# EAGLE board motor_shield (EAGLE 9.2.1)
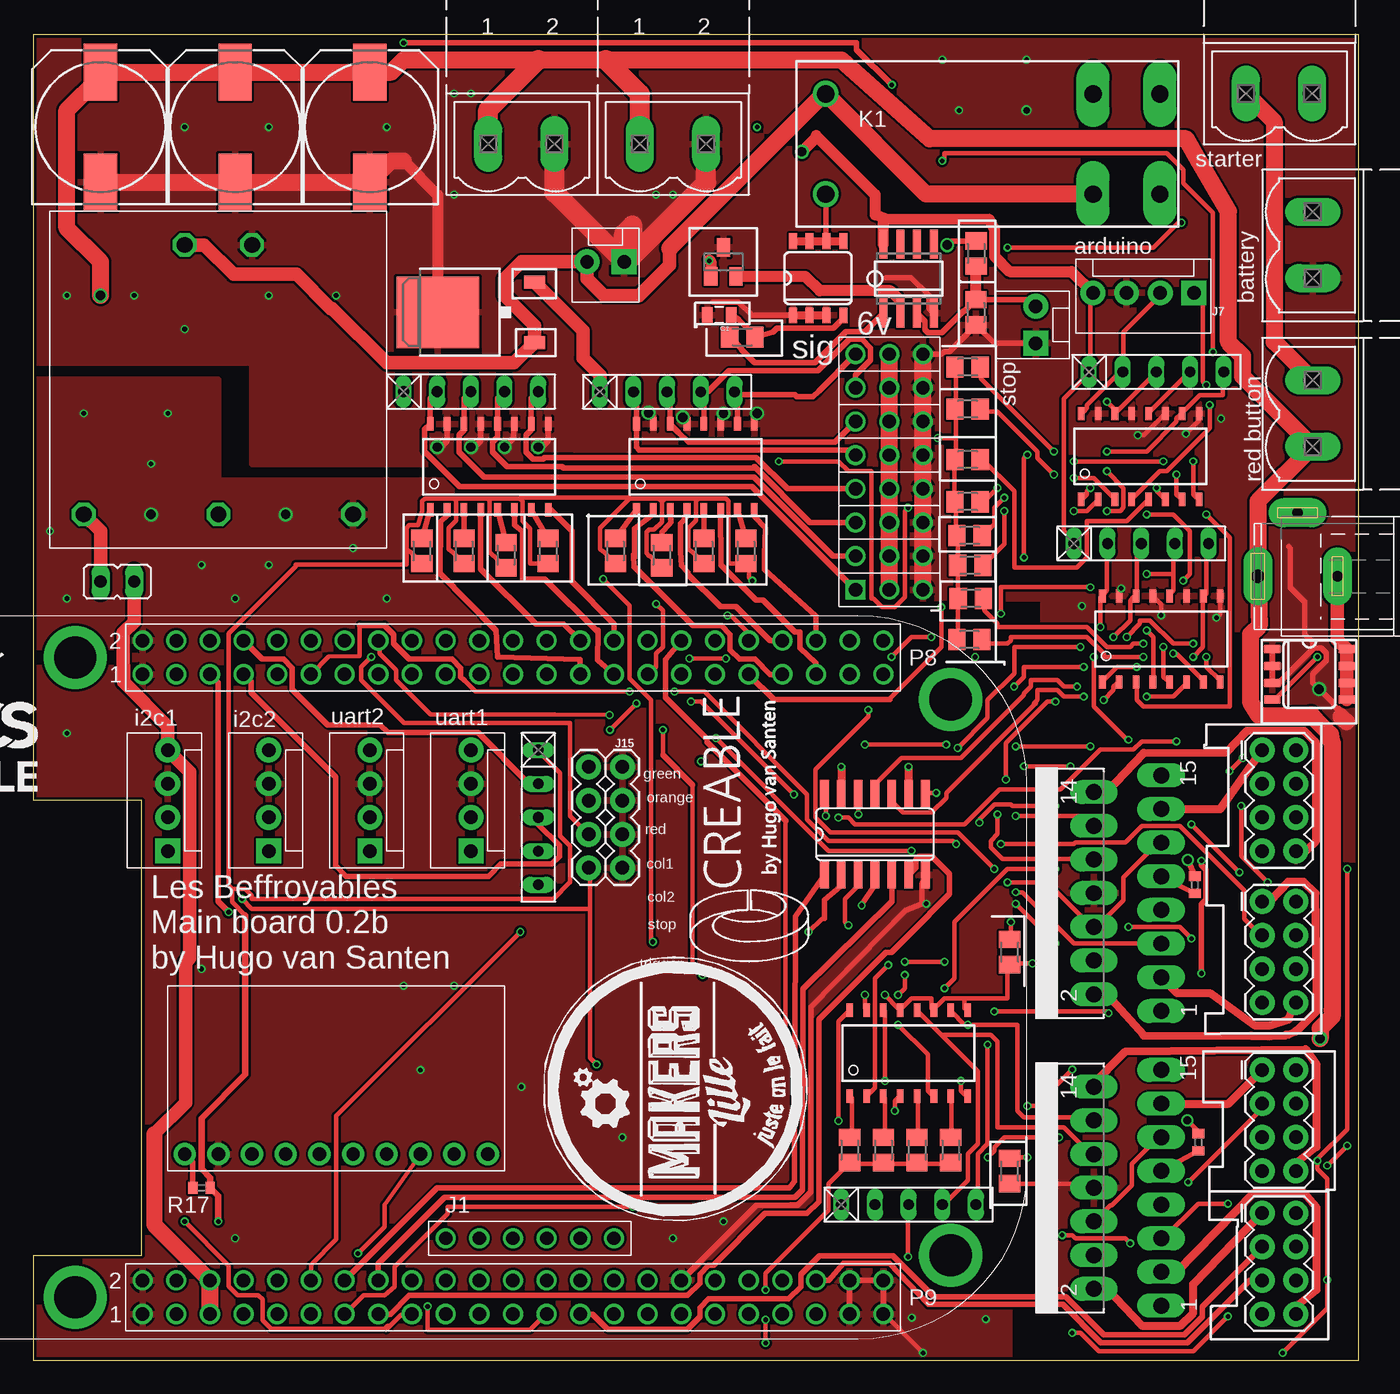
[diagram p3: board, top side]
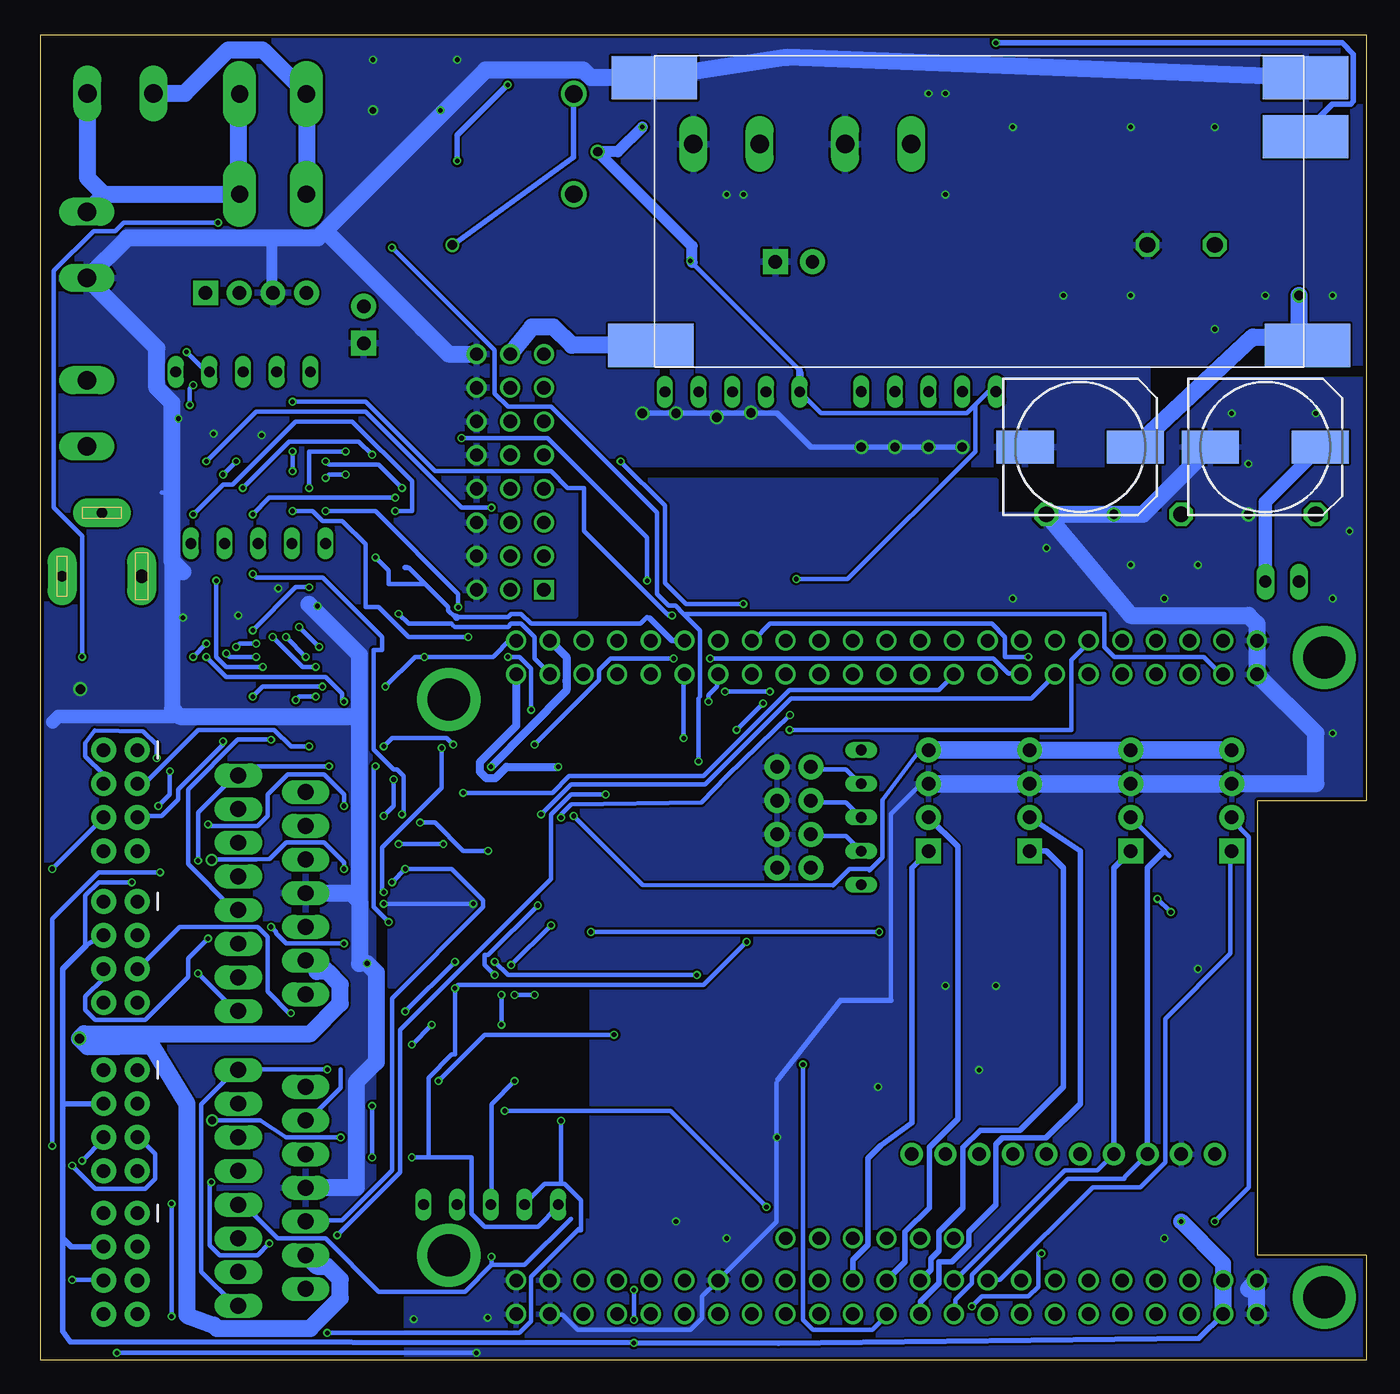
[diagram p4: board, bottom side, seen from below]

Size 100 x 100 mm. Coordinates in mm from the lower left corner, seen from the top.
Outline: 0,0 100,0 100,100 0,100 0,42.23 8.19,42.23 8.19,7.94 0,7.94 0,0
Copper layers (1*16): Top 0.035mm / dielectric 1.55mm / Bottom 0.035mm
Design rules "eC_2Layer_PClass6_BaseCopperO35 *": minimum track width 0.35mm, minimum drill 0.35mm, track to track 0.175mm, track to pad 0.175mm, pad to pad 0.175mm, via to via 0.175mm, smd to smd 0mil, copper to edge 0.25mm, drill to drill 0.35mm, minimum pad ring 0.175mm, minimum via ring 0.125mm, stop-mask expansion 0mil, vias tented up to drill 0.4mm, thermal gap 0.2mm

## Footprints (pad centres in the part's own frame; a part is rotated, then mirrored left to right if it is on the bottom)
SPARKFUN-CAPACITORS_0805 = smd 0.8 x 1.2: 1 -0.9,0; 2 0.9,0
ADAFRUIT_140CLH-1010 = smd 4.3 x 2.5: + 4.15,0; - -4.15,0
MULTIWATT-15 = drill 1.2 long: 1 -8.89,-7.62; 2 -7.62,-2.54; 3 -6.35,-7.62; 4 -5.08,-2.54; 5 -3.81,-7.62; 6 -2.54,-2.54; 7 -1.27,-7.62; 8 0,-2.54; 9 1.27,-7.62; 10 2.54,-2.54; 11 3.81,-7.62; 12 5.08,-2.54; 13 6.35,-7.62; 14 7.62,-2.54; 15 8.89,-7.62
SO14 = smd 0.66 x 2.032: 1 -3.81,-3.073; 2 -2.54,-3.073; 3 -1.27,-3.073; 4 0,-3.073; 5 1.27,-3.073; 6 2.54,-3.073; 7 3.81,-3.073; 8 3.81,3.073; 9 2.54,3.073; 10 1.27,3.073; 11 0,3.073; 12 -1.27,3.073; 13 -2.54,3.073; 14 -3.81,3.073
TO252 = smd 1 x 1.6: 1 -2.28,-4.8; 2 2.28,-4.8 | smd 5.4 x 6.2: 3 0,2.5
SOT23 = smd 1 x 1.4: 1 -0.95,-1.1; 2 0.95,-1.1; 3 0,1.1
SO08 = smd 0.6 x 2.2: 1 -1.905,-2.6; 2 -0.635,-2.6; 3 0.635,-2.6; 4 1.905,-2.6; 5 1.905,2.6; 6 0.635,2.6; 7 -0.635,2.6; 8 -1.905,2.6
2X4 = drill 1.016 pad 1.88: 1 -3.81,-1.27; 2 -3.81,1.27; 3 -1.27,-1.27; 4 -1.27,1.27; 5 1.27,-1.27; 6 1.27,1.27; 7 3.81,-1.27; 8 3.81,1.27
MOLEX-1X4 = drill 1.016 pad 1.88 square: 1 0,0 | drill 1.016 pad 1.88: 2 2.54,0; 3 5.08,0; 4 7.62,0
SPC4078 = drill 0.8 pad 2.184 long: 1 -3,0; 2 0,-4.8 | drill 1 pad 2.184 long: 3 3,0
MOLEX-1X2_LOCK = drill 1.016 pad 1.88 square: 1 -0.127,0 | drill 1.016 pad 1.88: 2 2.667,0
1X04 = drill 1.016 pad 1.88: 1 0,0; 2 2.54,0; 3 5.08,0; 4 7.62,0
JP1 = drill 0.914 long: 1 0,-1.27; 2 0,1.27
RT-N/O16A5 = drill 1.3 pad 2.5 long: 11A 7.56,3.78; 11B 7.56,-3.78; 14A 12.6,3.78; 14B 12.6,-3.78 | drill 1.3: A1 -12.6,-3.78; A2 -12.6,3.78
MINI-FLAT-16 = smd 1 x 0.5: 1 -3.24,4.445; 2 -3.24,3.175; 3 -3.24,1.905; 4 -3.24,0.635; 5 -3.24,-0.635; 6 -3.24,-1.905; 7 -3.24,-3.175; 8 -3.24,-4.445; 9 3.24,-4.445; 10 3.24,-3.175; 11 3.24,-1.905; 12 3.24,-0.635; 13 3.24,0.635; 14 3.24,1.905; 15 3.24,3.175; 16 3.24,4.445
BEAGLEBONE_BLACK_CAPE = drill 3.175: H1 14.605,3.175; H2 80.645,6.35; H3 80.645,48.26; H4 14.605,51.435 | drill 1.016: J1.1 42.545,7.62; J1.2 45.085,7.62; J1.3 47.625,7.62; J1.4 50.165,7.62; J1.5 52.705,7.62; J1.6 55.245,7.62; P8.1 19.685,50.165; P8.2 19.685,52.705; P8.3 22.225,50.165; P8.4 22.225,52.705; P8.5 24.765,50.165; P8.6 24.765,52.705; P8.7 27.305,50.165; P8.8 27.305,52.705; P8.9 29.845,50.165; P8.10 29.845,52.705; P8.11 32.385,50.165; P8.12 32.385,52.705; P8.13 34.925,50.165; P8.14 34.925,52.705; P8.15 37.465,50.165; P8.16 37.465,52.705; P8.17 40.005,50.165; P8.18 40.005,52.705; P8.19 42.545,50.165; P8.20 42.545,52.705; P8.21 45.085,50.165; P8.22 45.085,52.705; P8.23 47.625,50.165; P8.24 47.625,52.705; P8.25 50.165,50.165; P8.26 50.165,52.705; P8.27 52.705,50.165; P8.28 52.705,52.705; P8.29 55.245,50.165; P8.30 55.245,52.705; P8.31 57.785,50.165; P8.32 57.785,52.705; P8.33 60.325,50.165; P8.34 60.325,52.705; P8.35 62.865,50.165; P8.36 62.865,52.705; P8.37 65.405,50.165; P8.38 65.405,52.705; P8.39 67.945,50.165; P8.40 67.945,52.705; P8.41 70.485,50.165; P8.42 70.485,52.705; P8.43 73.025,50.165; P8.44 73.025,52.705; P8.45 75.565,50.165; P8.46 75.565,52.705; P9.1 19.685,1.905; P9.2 19.685,4.445; P9.3 22.225,1.905; P9.4 22.225,4.445; P9.5 24.765,1.905; P9.6 24.765,4.445; P9.7 27.305,1.905; P9.8 27.305,4.445; P9.9 29.845,1.905; P9.10 29.845,4.445; P9.11 32.385,1.905; P9.12 32.385,4.445; P9.13 34.925,1.905; P9.14 34.925,4.445; P9.15 37.465,1.905; P9.16 37.465,4.445; P9.17 40.005,1.905; P9.18 40.005,4.445; P9.19 42.545,1.905; P9.20 42.545,4.445; P9.21 45.085,1.905; P9.22 45.085,4.445; P9.23 47.625,1.905; P9.24 47.625,4.445; P9.25 50.165,1.905; P9.26 50.165,4.445; P9.27 52.705,1.905; P9.28 52.705,4.445; P9.29 55.245,1.905; P9.30 55.245,4.445; P9.31 57.785,1.905; P9.32 57.785,4.445; P9.33 60.325,1.905; P9.34 60.325,4.445; P9.35 62.865,1.905; P9.36 62.865,4.445; P9.37 65.405,1.905; P9.38 65.405,4.445; P9.39 67.945,1.905; P9.40 67.945,4.445; P9.41 70.485,1.905; P9.42 70.485,4.445; P9.43 73.025,1.905; P9.44 73.025,4.445; P9.45 75.565,1.905; P9.46 75.565,4.445
STRAWSON_EAGLE_LIB_SO08-TIGHT = smd 0.6 x 1.2: 1 -1.905,-2.8; 2 -0.635,-2.8; 3 0.635,-2.8; 4 1.905,-2.8; 5 1.905,2.8; 6 0.635,2.8; 7 -0.635,2.8; 8 -1.905,2.8
M0805 = smd 1.3 x 1.6: 1 -0.95,0; 2 0.95,0
R0402 = smd 0.7 x 0.9: 1 -0.65,0; 2 0.65,0
RN-5 = drill 0.813 long: 1 -5.08,0; 2 -2.54,0; 3 0,0; 4 2.54,0; 5 5.08,0
WRA-YMD = drill 1.194 octagon: (NC) 12.7,22.86; GND 10.16,2.54; V+ 22.86,22.86; V- 2.54,22.86; VIN 15.24,2.54
MPU9250 = drill 1 pad 1.676: AD0 0,7.62; ECL 0,10.16; EDA 0,12.7; FASYNC 0,0; GND 0,20.32; INT 0,5.08; NCS 0,2.54; SCL 0,17.78; SDA 0,15.24; VCC 0,22.86
STRAWSON_EAGLE_LIB_3X8_0.1"_HEADER = drill 1 square: P$1 -2.54,-17.78 | drill 1: P$2 -2.54,-15.24; P$3 -2.54,-12.7; P$4 -2.54,-10.16; P$5 -2.54,-7.62; P$6 -2.54,-5.08; P$7 0,-17.78; P$8 0,-15.24; P$9 0,-12.7; P$10 0,-10.16; P$11 0,-7.62; P$12 0,-5.08; P$13 2.54,-17.78; P$14 2.54,-15.24; P$15 2.54,-12.7; P$16 2.54,-10.16; P$17 2.54,-7.62; P$18 2.54,-5.08; P$19 -2.54,-2.54; P$20 -2.54,0; P$21 0,-2.54; P$22 0,0; P$23 2.54,-2.54; P$24 2.54,0
XL6009 = smd 6.452 x 3.251: EN -0.127,6.096; IN+ -0.254,21.844; IN- -0.127,1.651; OUT+ 49.276,21.844; OUT- 49.022,1.651
MSTBV2 = drill 1.397 long: 1 -2.5,0; 2 2.5,0

## Placement (x,y rotation side)
C1  [SPARKFUN-CAPACITORS_0805]  51.76,78.85 180 top
C2  [ADAFRUIT_140CLH-1010]  5.08,93.03 90 top
C3  [ADAFRUIT_140CLH-1010]  15.24,93.03 90 top
C4  [ADAFRUIT_140CLH-1010]  25.4,93.03 90 top
C5  [ADAFRUIT_140CLH-1010]  21.59,68.9 0 bottom
C6  [ADAFRUIT_140CLH-1010]  7.62,68.9 0 bottom
IC1  L298  [MULTIWATT-15]  77.47,13.02 90 top
IC2  L298  [MULTIWATT-15]  77.47,35.24 90 top
IC3  4030D  [SO14]  63.5,39.69 0 top
IC4  7805DT  [TO252]  33.02,79.06 90 top
IC5  MAX6520  [SOT23]  52.07,82.87 0 top
IC6  LM358D  [SO08]  66.04,81.6 0 top
J1  [2X4]  93.98,7.3 270 top
J2  [MOLEX-1X4]  25.4,38.42 90 top
J3  [2X4]  93.98,18.1 270 top
J4  [2X4]  93.98,30.8 270 top
J5  [2X4]  93.98,42.23 270 top
J6  [MOLEX-1X4]  33.02,38.42 90 top
J7  [MOLEX-1X4]  87.56,80.52 180 top
J8  [MOLEX-1X4]  10.16,38.42 90 top
J9  [MOLEX-1X4]  17.78,38.42 90 top
J11  [SPC4078]  95.38,59.14 180 top
J12  [MOLEX-1X2_LOCK]  75.64,76.85 90 top
J14  [MOLEX-1X2_LOCK]  44.45,82.87 180 top
J15  [1X04]  44.45,44.77 270 top
J16  [1X04]  41.91,37.15 90 top
JP1  [JP1]  6.35,58.74 270 top
K1  RT33K012  [RT-N/O16A5]  72.39,91.76 0 top
OPT_MISC  TLP283-4  [MINI-FLAT-16]  83.5,68.19 90 top
OPT_MOT1  TLP283-4  [MINI-FLAT-16]  66.04,23.18 90 top
OPT_MOT2  TLP283-4  [MINI-FLAT-16]  85.1,54.41 90 top
OPT_SERVO1  TLP283-4  [MINI-FLAT-16]  34.4,67.4 90 top
OPT_SERVO2  TLP283-4  [MINI-FLAT-16]  49.96,67.4 90 top
PCB1  BEAGLEBONE_BLACK_CAPE  [BEAGLEBONE_BLACK_CAPE]  -11.43,1.59 0 top
Q5  STRAWSON_EAGLE_LIB_MOSFET-NCHANNEL  [STRAWSON_EAGLE_LIB_SO08-TIGHT]  96.28,51.74 270 top
Q6  STRAWSON_EAGLE_LIB_MOSFET-NCHANNEL  [STRAWSON_EAGLE_LIB_SO08-TIGHT]  59.21,81.63 0 top
R1  0.5  [M0805]  73.66,14.29 270 top
R2  0.5  [M0805]  73.66,30.8 270 top
R3  220  [M0805]  70.64,62.22 0 top
R4  6k  [M0805]  53.5,77.18 180 top
R5  220  [M0805]  70.69,59.97 0 top
R7  220  [M0805]  70.73,57.48 0 top
R9  220  [M0805]  70.63,54.37 0 top
R11  6k  [M0805]  71.14,83.49 90 top
R12  3k  [M0805]  71.12,79.06 90 top
R15  [R0402]  87.91,16.45 270 top
R16  [R0402]  87.63,35.88 270 top
R17  [R0402]  12.7,13.02 180 top
R19  220  [M0805]  61.59,15.88 90 top
R21  220  [M0805]  64.14,15.88 90 top
R23  220  [M0805]  66.67,15.88 90 top
R25  220  [M0805]  69.22,15.88 90 top
R27  220  [M0805]  70.48,74.93 0 top
R29  220  [M0805]  70.48,71.75 0 top
R31  220  [M0805]  70.48,67.94 0 top
R33  220  [M0805]  70.48,64.77 0 top
R35  220  [M0805]  29.32,61.05 90 top
R37  220  [M0805]  32.5,61.05 90 top
R39  220  [M0805]  35.67,60.74 90 top
R41  220  [M0805]  38.85,61.05 90 top
R51  220  [M0805]  43.93,61.05 90 top
R53  220  [M0805]  47.42,60.74 90 top
R55  220  [M0805]  50.59,61.05 90 top
R57  220  [M0805]  53.77,61.05 90 top
RN2  680  [RN-5]  84.73,74.56 0 top
RN3  680  [RN-5]  66.04,11.75 0 top
RN4  680  [RN-5]  83.59,61.62 0 top
RN5  680  [RN-5]  47.82,73.07 0 top
RN6  680  [RN-5]  33.02,73.07 0 top
RN7  [RN-5]  38.1,40.96 270 top
U$1  WRA-YMD  [WRA-YMD]  26.67,86.68 180 top
U$2  MPU9220  [MPU9250]  34.29,15.56 90 top
U$3  LOGO  [LOGO]  58.54,30.03 90 top
U$4  STRAWSON_EAGLE_LIB_SERVO_HEADERS_8X  [STRAWSON_EAGLE_LIB_3X8_0.1"_HEADER]  64.58,75.91 0 top
U$5  XL6009  [XL6009]  4.7,98.41 180 bottom
U$6  LOGO_MAKERS  [LOGO_MAKERS]  58.42,10.48 90 top
X1  [MSTBV2]  96.52,71.44 270 top
X2  [MSTBV2]  93.98,95.57 0 top
X3  [MSTBV2]  96.52,84.14 270 top
X5  [MSTBV2]  48.26,91.76 0 top
X6  [MSTBV2]  36.83,91.76 0 top

## Tracks (layer width: path | path; a pad name or v marks a point on that pad's centre or on a via)
+3V3  (via drill 0.35)
  Top 0.35: v90.25,44.44 v91.25,45.44 | v91.12,41.82 91.12,38.07 v93.12,36.07 | 69.75,62.32 69.75,60.07 R5.1 69.75,59.82 69.75,57.57 | 69.62,69.57 69.62,68.07 R31.1 69.5,68.07 69.5,64.94 R33.1 69.62,64.69 69.62,62.32 69.75,62.32 | 69.62,69.57 69.62,71.57 | 69.62,71.57 69.62,71.69 | v68.25,69.57 69.62,69.57 | v54.25,58.82 54,59.07 54,60.07 R57.1 52.57,60.1 52.47,60.2 52.47,64.81 52.26,65.01 50.2,65.01 | 69.75,57.57 69.75,54.44 R9.1 | 28.17,61.21 28.38,61 28.42,61 R35.1 | 28.17,61.21 28.17,61.32 28.17,62.8 28.38,63 29.04,63 29.36,64.08 29.36,64.81 29.56,65.01 31.75,65.01 | 28.17,61.21 28.17,60.05 19.81,60.05 19.81,59.88 14.75,54.82 14.75,35.82 15,35.57 | 36.7,65.01 36.91,64.81 36.91,63.31 37.48,62.74 37.48,60.1 R41.1 | 31.75,65.01 34.29,65.01 | 34.29,65.01 36.7,65.01 | 34.29,65.01 34.44,64.87 34.44,60.98 34.73,60.69 34.77,60.69 R39.1 | 31.75,65.01 31.9,64.87 31.9,63.35 31.35,62.8 31.35,61.21 31.55,61 31.6,61 R37.1 | 44.99,65.01 42.78,62.8 42.78,61.21 42.98,61 43.03,61 R51.1 | 44.99,65.01 47.18,65.01 | 47.66,65.01 50.2,65.01 | 47.42,64.77 47.66,65.01 | 47.18,65.01 47.42,64.77 | 47.42,64.77 47.42,63.25 46.85,62.69 46.48,62.69 46.27,62.48 46.27,60.89 46.48,60.69 46.52,60.69 R53.1 | 50.2,65.01 49.99,64.81 49.99,63.35 49.45,62.8 49.45,61.21 49.65,61 49.7,61 R55.1 | 47.66,65.01 47.18,65.01 | 36.7,65.01 36.75,65.07 45,65.07 44.99,65.01 | 69.75,57.57 R7.1 | R27.1 69.5,74.82 69.62,74.82 69.62,71.82 R29.1 69.5,71.57 69.62,71.57 | 69.75,62.32 R3.1 | R25.1 69,14.82 66.75,14.82 R23.1 66.5,14.82 64.25,14.82 R21.1 64,14.82 61.75,14.82 R19.1 61.5,14.82 60,13.32 60,11.32 55.25,6.57 v55.25,5.32
  Top 0.35: 15,35.57 16,35.57 16.5,35.07 16.5,34.82 39.25,34.82 40.48,36.04 40.5,36.07 40.5,38.82 39.75,39.57 39.75,44.32 38.25,45.82 RN7.1 | 15,35.57 15,34.57 16,33.57 | v55.25,1.32 v55.25,3.07
  Top 0.508: 16,33.57 16,21.57 12.7,18.27 12.7,14.43 13.35,13.78 R17.1 13.97,12.4 v13.97,10.48
  Bottom 0.35: J5.4 95.25,44.19 96.62,45.57 96.62,46.57 95.93,47.5 92.25,47.44 91.25,46.44 v91.25,45.44 | v90.25,44.44 90.25,42.69 v91.12,41.82 | v93.12,36.07 95.62,36.07 96.62,35.07 96.62,31.44 96.58,31.35 | v68.25,69.57 61.75,69.57 54.25,62.07 v54.25,58.82 | v55.25,3.07 v55.25,5.32 | v55.25,1.32 v55.25,1.31
  Bottom 0.406: J4.4 96.58,31.35 96.58,31.3 98.35,29.53 98.35,19.37 | 98.35,19.37 98.35,9.21 | 98.35,9.21 98.35,2.21 97.75,1.4 v55.25,1.31 44.36,1.29 12.64,1.65 PCB1.P9.3 | J3.4 98.35,19.37 | J1.4 97.71,8.57 98.35,9.21
  Bottom 1.2: PCB1.P9.4 10.79,7.3 v13.97,10.48
  Bottom 1.27: PCB1.P9.3 PCB1.P9.4
+4.1V
  Top 1.27: U$4.P$7 U$4.P$8 U$4.P$9 U$4.P$10 U$4.P$11 U$4.P$12 U$4.P$21 U$4.P$22
  Bottom 1.27: U$5.OUT+ 59.93,76.57 61.32,77.96 62.95,77.96 U$4.P$22
+5V  (via drill 0.35, 0.6, 0.7)
  Top 0.35: v77.38,16.82 73.25,16.82 72.5,16.07 72.5,15.82 v72,15.32 | v77.12,37.07 73.5,37.07 69.5,33.07 69.5,28.82 v68.75,28.07 | 78.62,61.44 RN4.1 78.5,61.82 77.75,62.57 77.75,72.57 79.5,74.32 RN2.1 79.75,74.57 79.75,80.32 J7.4 | v51,82.94 51.12,82.9 | v43,58.94 45,56.94 45,51.44 46.62,49.82 46.62,31.7 v46.75,31.57 | v87.08,18.1 87.91,17.26 R15.1
  Top 0.406: v87.09,37.74 R16.1
  Top 0.813: 64.45,86.05 72.12,86.07 72.52,85.33 72.52,83.28 73.66,82.14 78.33,82.14 J7.4 | 64.45,86.05 63.5,86.42 63.5,87.95 59.05,92.39 59.05,92.24 v57.98,91.17 | 50.99,83.03 51.12,82.9 IC5.1 | IC6.8 64.14,86.18 64.45,86.05
  Top 1: IC4.2 41.48,77.68 41.48,75.61 42.74,74.34 RN5.1
  Bottom 0.35: 61,11.82 RN3.1 61,11.57 62.5,10.07 66.5,10.07 67.5,11.07 67.5,15.32 70.75,15.32 | 83.82,18.12 83.43,18.12 81.5,16.82 v77.38,16.82 | 83.82,18.12 84.42,18.11 | v77.12,37.07 77.12,37.57 78.62,39.07 81.5,39.07 82.73,37.84 83.69,37.8 86.89,37.8 | 29.56,72.01 30.12,71.44 41.12,71.44 42.62,72.94 42.62,73.98 42.62,74.49 | 29.56,72.01 28.5,73.07 28,73.07 RN6.1 | 78.62,61.57 RN4.1 | v51,82.94 50.86,82.8 42.75,74.69 | v43,58.94 39.12,58.94 29.5,68.57 29.5,71.94 29.56,72.01 | 83.82,18.12 87.06,18.12 v87.08,18.1 | v72,15.32 70.75,15.32 | 70.75,15.32 70.75,21.32 69,23.07 68.75,23.07 v68.75,28.07 68.5,28.32 50,28.32 v46.75,31.57
  Bottom 0.406: 79.65,80.24 J7.4 | 86.89,37.8 v87.09,37.74
  Bottom 0.5: 42.62,73.98 42.75,74.1 42.75,74.69 | RN5.1 42.62,72.95 42.62,72.94
  Bottom 0.813: 50.86,82.8 50.86,84.05 v57.98,91.17 56.47,91.17 v54.61,93.03
+12V  (via drill 0.7)
  Top 0.406: R11.2 69.25,84.44 v68.94,84.14
  Top 1: U$1.VIN 12.9,84.14 15.11,81.93 19.88,81.93 22.46,79.35 22.57,79.35 26.67,75.25 36.29,75.25 IC4.1 37.82,78.07 35.56,80.33 35.56,81.6 36.83,82.87 J14.2 41.78,81.6 43.05,80.33 45.72,80.33 48.01,82.61 48.01,83.88
  Top 1.27: X2.1 93.61,93.43 93.61,76.84 X1.1 | K1.11B 67.35,87.98 K1.A2 59.66,95.54 48.01,83.88
  Bottom 0.406: v68.94,84.14 59.79,90.75 K1.A2
  Bottom 1.27: X2.1 89.12,95.57 85.84,98.85 83.26,98.85 K1.11A K1.11B
+12V_PWR  (via drill 0.7)
  Top 1.27: v97.08,24.28 97.08,25.04 97.98,25.94 97.98,25.96 97.99,25.96 97.98,26.42 97.98,46.68 97.88,46.78 97.89,47 97.86,47.03 97.86,47.22 96.69,48.39 96.41,48.71 96.36,48.71 96.18,48.66 92.45,48.66 91.83,49.68 91.83,54.76 92.48,55.41 J11.3 92.38,64.8 X1.2 91.23,74.22 91.23,75.76 90.17,76.82 90.17,86.68 87.91,90.49 86.97,92.14 67.64,92.14 60.96,98.11 43.18,98.11 38.1,98.11 27.94,98.11 27.01,97.18 C4.+ C3.+ C2.+ 5.08,96.84 2.54,94.3 2.54,85.41 5.08,82.87 v5.08,80.33
  Top 1.5: X6.1 34.33,94.34 38.1,98.11 | X5.1 45.76,95.53 43.18,98.11
  Bottom 1.27: 78.4,29.33 77.4,28.33 77.4,26.91 79.67,24.64 96.72,24.64 v97.08,24.28 96.46,23.66 91.61,23.71 88.97,19.37 88.97,3.42 86.94,2.66 86.7,2.42 79.67,2.42 77.4,4.69 77.4,6.11 78.4,7.11 79.18,7.11 IC1.4 | 78.4,29.33 79.18,29.33 | v5.08,80.33 5.08,77.2 | 5.08,77.2 U$5.IN+ | IC2.4 79.23,30.16 78.4,29.33 | C5.+ 8.55,77.2 5.08,77.2
COL2  (via drill 0.35)
  Top 0.35: v42.5,22.32 42,22.82 42,34.07 | 42,34.07 42,37.07 J16.1 | v15.75,34.82 16.5,34.07 42,34.07 | v14.75,33.82 v14.76,33.82
  Top 0.406: v14.76,33.82 13.97,34.61 13.97,51.12 PCB1.P8.5
  Bottom 0.35: v42.5,22.32 42.5,3.07 41.75,2.32 37.25,2.32 36.25,3.32 PCB1.P9.23 | v15.75,34.82 v14.75,33.82
DOOR_MOT_1A  (via drill 0.35)
  Top 0.35: v64.5,29.82 63.5,28.82 63.5,20.57 63,20.07 OPT_MOT1.2 | v61.5,32.82 61.25,33.07 61.25,34.82 62.25,35.82 IC3.3
  Top 0.406: 62.23,35.88 IC3.3
  Bottom 0.35: v61.5,32.82 v64.5,29.82
DOOR_MOT_2A  (via drill 0.35)
  Top 0.35: v65.25,25.32 67.5,23.07 67.5,20.32 67.75,20.07 OPT_MOT1.6 | v65.25,27.57 65.75,28.07 v65.75,29.07 | v62.5,34.32 62.48,34.37
  Top 0.406: 62.48,34.37 63.5,35.88 IC3.4
  Bottom 0.35: v65.25,27.57 v65.25,25.32 | v65.75,29.07 66.5,29.82 66.5,30.57 66.25,30.57 v62.5,34.32
DOOR_MOT_3A  (via drill 0.35)
  Top 0.35: 75.56,49.51 68.88,42.82 68.88,42.44 67.75,41.32 65.62,41.32 64.88,42.07 64.88,42.69 IC3.10 | 75.56,49.51 75.62,49.57 | v80.75,49.82 81.5,50.57 81.5,50.82 81.75,51.07 OPT_MOT2.2 | v79.25,50.07 77.75,50.07 77.25,50.57 75.75,50.57 75.75,49.82 75.5,49.57 75.56,49.51
  Bottom 0.35: v80.75,49.82 80.5,50.07 v79.25,50.07
DOOR_MOT_4A  (via drill 0.35)
  Top 0.35: IC3.11 63.5,43.44 65.5,45.44 70,45.44 74.75,50.19 74.75,50.32 75.25,50.82 75.25,51.32 77.25,51.32 77.75,50.82 v78.75,50.82 | v84,50.07 86,50.07 87,51.07 OPT_MOT2.6
  Bottom 0.35: v84,50.07 83.25,50.82 v78.75,50.82
ENC_1A
  Top 0.406: PCB1.P9.42 60.01,6.03 61.13,7.31 64.6,7.31 67.53,4.22 77.66,4.22 80.55,1.33 87.06,1.33 91.76,6.03 J1.5
ENC_1B
  Top 0.406: PCB1.P9.27 42.2,3.49 43.34,2.35 49.37,2.35 50.3,3.28 50.3,3.96 50.96,4.63 56.99,4.63 57.91,5.56 57.91,6.5 59.3,7.89 64.37,7.89 64.37,7.9 64.61,7.89 64.85,7.89 67.94,4.8 77.9,4.8 80.76,1.94 83.33,1.94 83.33,1.93 83.62,1.93 83.89,1.92 83.9,1.93 86.83,1.93 88.19,3.28 88.19,4.05 J1.3
ENC_2A  (via drill 0.35)
  Top 0.35: v51.5,46.94 60,38.44 v66.25,38.44 | v71.38,40.57 71.38,40.82 72.5,41.94 73.75,41.94 73.88,41.82 v77.12,41.82 | v91,36.82 v87.38,40.44 | v97.62,14.69 v99.12,16.19
  Bottom 0.35: v51.5,46.94 51.5,51.69 PCB1.P8.35 | v66.25,38.44 68.12,38.44 70.25,40.57 v71.38,40.57 | v77.12,41.82 77.12,42.69 78.62,44.19 81.38,44.19 82.88,42.69 82.88,41.07 83.62,40.32 87.25,40.32 v87.38,40.44 | v91,36.82 95.62,36.82 99.12,33.32 v99.12,16.19 | v97.62,14.69 95.88,12.94 92.12,12.94 91.38,13.69 91.38,15.57 92.62,16.82 J3.5
ENC_2B  (via drill 0.35)
  Top 0.35: v49.62,49.69 50.38,49.69 v57.38,42.69 | v77.62,9.44 78.38,9.44 78.62,9.19 82.38,9.19 v82.75,8.82 | v87.12,13.44 92.62,18.94 92.62,19.19 J3.3
  Bottom 0.35: v49.62,49.69 49.62,50.19 49,50.82 49,51.69 PCB1.P8.33 | v57.38,42.69 60,42.69 61.5,41.19 61.5,36.32 72.88,24.94 72.88,14.19 v77.62,9.44 | v82.75,8.82 83.62,7.94 86.5,7.94 87.25,8.69 87.25,13.32 v87.12,13.44
ENC_3A  (via drill 0.35)
  Top 0.35: v45.5,49.57 v43.5,47.57 | 47.5,45.67 v47.5,47.57 | v72.5,26.32 81,26.32 v81.12,26.19 | v65.75,30.07 v68.75,30.07 | v50.5,29.07 49.75,29.82 49.75,43.42
  Top 0.406: 47.5,45.67 49.75,43.42
  Bottom 0.35: v81.12,26.19 81.25,26.19 82.88,27.82 82.88,31.94 83.62,32.69 89.5,32.69 92.62,29.57 J4.5 | v43.5,47.57 22.25,47.57 22.25,52.82 21,54.07 PCB1.P8.12 | v47.5,47.57 v45.5,49.57 | v68.75,30.07 v72.5,26.32 | v65.75,30.07 64.75,29.07 v50.5,29.07
ENC_3B  (via drill 0.35)
  Top 0.35: PCB1.P8.11 22.3,53.1 24.63,53.12 24.63,55.44 | 32.5,51.32 33.38,50.44 v45,50.44 | v48.38,50.44 50.62,50.44 58.38,42.69 58.38,40.82 60,39.19 69.38,39.19 v69.62,38.94 | v73,38.94 78.5,38.94 78.62,39.07 82.38,39.07 83.62,40.32 86.5,40.32 91.38,35.44 91.38,33.32 92.62,32.07 J4.3
  Top 0.406: 24.63,55.44 26.5,55.44 27.18,54.76 27.18,54.08 28.36,52.89 31.59,52.89 32.26,52.22 32.26,51.56 32.5,51.32
  Bottom 0.35: v48.38,50.44 v45,50.44 | v73,38.94 v69.62,38.94
ENC_4A  (via drill 0.35)
  Top 0.35: v43.48,48.69 39.35,48.71 29.98,48.71 27.38,51.32 27.38,52.07 26.12,53.32 26.12,54.19 PCB1.P8.16 | v60.75,40.94 61.5,40.94 62,40.44 70.25,40.44 72.88,43.07 77.5,43.07 80.5,46.07 83,46.07 83.62,46.69 v86.25,46.69
  Bottom 0.35: v43.48,48.69 48.22,44.08 50.14,42.08 60,41.94 60.75,41.19 v60.75,40.94 | v86.25,46.69 86.25,46.44 89.62,43.07 89.62,42.32 90.88,41.07 92.62,41.07 J5.5
ENC_4B  (via drill 0.35)
  Top 0.35: v52.25,52.94 v49.5,52.94 | v68.88,46.44 v62.75,46.44 | v79.75,46.32 v74.12,46.32
  Bottom 0.35: v49.5,52.94 28.12,52.94 27,51.82 26.12,51.82 PCB1.P8.15 | v52.25,52.94 57,52.94 57.88,52.07 57.88,51.32 v62.75,46.44 | v68.88,46.44 69.38,46.94 73.5,46.94 v74.12,46.32 | v79.75,46.32 81.12,46.32 82.38,47.57 88.12,47.57 92.12,43.57 92.62,43.57 J5.3
GND  (via drill 0.35, 0.5, 0.7)
  Top 0.35: IC1.8 80,13.07 79.75,13.32 73.75,13.32 R1.2 73.5,13.32 | v75.38,29.94 73.75,29.94 R2.2 73.5,29.82 73.5,27.32 70.25,27.32 | v62.75,27.57 62.75,26.57 OPT_MOT1.15 | v64.25,27.57 65.25,26.57 OPT_MOT1.13 65.5,26.57 66.25,27.32 67.75,27.32 67.75,26.57 OPT_MOT1.11 68,26.57 68.75,27.32 70.25,27.32 | 70.25,27.32 70.25,26.57 OPT_MOT1.9 | v83.33,69.79 83.77,69.79 OPT_MISC.11 | v86.96,69.9 87.95,70.89 OPT_MISC.9 | OPT_MOT2.15 81.92,58.07 v82.08,58.23 | v85.09,56.2 85.09,57.02 OPT_MOT2.13 | OPT_MOT2.9 89.54,56.31 v89.26,56.03
  Top 0.406: IC6.4 67.56,79.39 67.56,80.34 66.23,81.67 64.33,81.67 | U$4.P$24 68.53,75.91 68.73,76.11 69.12,76.11 R12.1 72.51,76.72 J12.1 | OPT_SERVO1.15 31.23,69.36 30.77,68.9 v30.48,68.9 | OPT_SERVO1.13 33.77,69.36 33.31,68.9 v33.02,68.9 | OPT_SERVO1.11 36.31,70.18 36.25,70.12 36.25,69.59 v35.56,68.9 | OPT_SERVO1.9 38.85,69.36 38.39,68.9 v38.1,68.9 | OPT_SERVO2.15 46.78,71.11 v46.42,71.48 | OPT_SERVO2.13 49.01,70.96 v49.01,71.14 | OPT_SERVO2.11 51.87,71.23 v52.07,71.44 | OPT_SERVO2.9 54.41,71.23 v54.61,71.44 | IC4.3 31.01,78.28 | C1.2 50.9,78.79 50.87,78.81 | 51.3,79.83 53.22,79.83 54.22,78.83 Q6.1 | Q5.1 Q5.2 Q5.3 93.96,51.11 96.51,53.66 | 96.51,53.66 96.59,53.75 97.16,53.75 97.55,53.35 97.55,52.79 96.53,51.76 96.53,51.11 v97.01,50.63 98.1,49.54 98.1,49.38 98.32,49.16 98.48,49.16 98.54,48.75 98.65,48.54 | 94.71,61.37 94.84,61.24 94.84,58.3 95.94,57.2 95.94,54.77 96.51,54.19 96.51,53.66
  Top 0.61: Q6.1 Q6.2 Q6.3
  Top 0.813: 27.94,90.49 30.52,87.91 IC4.3 | 31.75,79.06 IC4.3 | IC4.3 32.46,79.06
  Top 1.27: U$4.P$13 U$4.P$14 U$4.P$15 U$4.P$16 U$4.P$17 U$4.P$18 U$4.P$23 U$4.P$24 | 98.65,48.54 99.09,48.16 | C2.- C3.- C4.- 27.01,90.49 27.94,90.49
  Top 1.5: X6.2 39.33,88.11 J14.1 44.58,85.01 45.18,85.61 45.18,83.26 50.76,88.84 X5.2
  Bottom 0.35: v75.38,29.94 75.95,29.94 | 90.88,65.44 90.09,65.44 | v64.25,27.57 v62.75,27.57
  Bottom 0.406: 71.19,77.91 71.19,77.86 | v30.48,68.9 v33.02,68.9 v35.56,68.9 v38.1,68.9 41.91,68.9 44.45,71.44 46.46,71.44 | 46.46,71.44 49.53,71.44 | 49.53,71.44 v52.07,71.44 v54.61,71.44 | v46.42,71.48 46.46,71.44 | v49.01,71.14 49.23,71.14 49.53,71.44
  Bottom 0.813: J7.3 82.55,80.59 82.55,84.67
  Bottom 1.016: 89.5,48.58 98.67,48.58 99.09,48.16
  Bottom 1.2: 90.09,60.31 90.09,49.17 89.5,48.58
  Bottom 1.27: 75.95,34.61 75.95,48.58 | 75.95,48.58 75.95,53.22 79.78,57.04 | 75.95,34.61 75.95,29.94 | v75.38,29.94 74.69,29.25 74.69,22.51 76.2,20.99 76.2,13.02 IC1.8 | IC2.8 76.59,35.24 75.95,34.61 | U$5.IN- 43.69,98.3 U$5.OUT- 58.49,96.76 59.05,97.32 66.44,97.32 78.55,85.22 | 78.55,85.22 79.1,84.67 82.55,84.67 93.49,84.67 X3.2 91.23,76.35 91.23,73.37 90.09,72.22 90.09,65.44 90.09,60.31 89.26,59.48 | 78.55,85.22 71.19,77.86 69.24,75.91 U$4.P$24 | 89.5,48.58 75.95,48.58
  other vias: 11.43,77.79 7.62,80.33 2.54,80.33 17.78,80.33 22.86,80.33 31.75,87.95 33.02,95.57 31.75,95.57 74.93,94.3 69.85,94.3 68.58,98.11 74.93,98.11 46.99,87.95 48.26,87.95 11.43,93.03 17.78,93.03 26.67,93.03 79.12,56.9 89.61,71.04
  pour Top: -5.08,75.25 16.51,75.25 16.51,67.63 59.69,67.63 59.69,57.47 76.2,57.47 76.2,-4.76 113.03,-4.76 113.03,108.27 -5.08,108.27
  pour Bottom: -5.08,75.25 -5.08,109.54 114.3,109.54 114.3,-4.76 74.93,-4.76 74.93,56.2 59.69,56.2 59.69,67.63 16.51,67.63 16.51,75.25
GREEN
  Top 0.35: RN7.2 38,43.57 37.5,43.57 37.42,43.5
  Top 0.406: PCB1.P8.8 17.27,52.89 18.89,52.89 19.55,52.22 19.55,50.61 22.23,47.94 26.19,47.94 26.77,47.36 33.57,47.36 37.42,43.5
  Bottom 0.35: RN7.2 38.25,43.57 39.25,44.57 41.75,44.57 J16.4
I2C1_SCL  (via drill 0.35)
  Top 0.35: 26.62,2.32 26.92,2.61 | 26.92,2.61 27.75,3.44 28.5,3.44 PCB1.P9.17 | 26.92,2.61 26.73,2.61 26.5,2.38 17.95,2.38 17.3,3.03 17.3,4.6 16.99,4.92 15.41,4.92 14.76,5.57 14.76,7.14 v11.43,10.48
  Bottom 0.35: J8.2 10.16,40.79 8.87,39.5 8.87,13.04 v11.43,10.48
I2C1_SDA
  Bottom 0.35: PCB1.P9.18 28.5,6.07 27.62,6.07 20.62,13.07 17.05,13.07 15.17,14.95 15.17,25.78 10.25,30.69 10.25,38.32 J8.1
I2C2_SCL
  Bottom 0.35: PCB1.P9.19 31,3.57 31,4.57 29.75,5.82 29.75,6.44 22.5,13.69 18.27,13.69 18.23,13.84 U$2.SCL | 14.88,38.07 15.23,38.43 17.75,40.94 J9.2
  Bottom 0.406: 15.23,38.43 16.51,37.15 U$2.SCL
I2C2_SDA
  Bottom 0.35: U$2.SDA 20.29,14.32 22.75,14.32 31,6.07 PCB1.P9.20 | 17.75,38.32 J9.1
  Bottom 0.406: J9.1 19.05,37.15 U$2.SDA
INT_ACC  (via drill 0.35)
  Top 0.35: v29.75,4.07 29.75,2.32 37.5,2.32 38.5,3.32 PCB1.P9.25 | v24.5,8.07 26.5,10.07 26.5,11.73 U$2.INT
  Bottom 0.35: v29.75,4.07 29,4.82 25.5,4.82 24.75,5.57 24.75,8.07 v24.5,8.07
MOT1+
  Top 0.61: IC1.2 81,5.4 83.63,2.61 86.55,2.61 87.51,3.57 87.51,5.75 J1.1
MOT1-
  Top 0.61: IC1.3 86.29,6.67 92.13,12.67 95.83,12.67 96.81,11.53 96.81,5.3 95.25,4.06 J1.8
MOT2+
  Top 0.61: IC1.13 90.17,19.37 J3.1
MOT2-
  Top 0.61: IC1.14 79.73,20.64 82.4,23.3 95.99,23.46 96.81,22.33 96.81,16.09 95.25,14.85 J3.8
MOT3+
  Top 0.61: IC2.2 81,27.62 83.78,24.51 91.89,24.48 91.94,24.47 92.19,24.46 93.1,24.46 93.22,24.45 93.39,24.46 94.45,24.51 94.52,24.58 94.71,24.58 95.21,24.81 95.46,25 96.87,26.41 96.73,35.24 95.83,36.1 94.67,36.1 93.27,34.61 J4.1
MOT3-
  Top 0.61: IC2.3 86.27,27.71 88.74,27.71 92.13,25.27 93.29,25.27 94.69,25.72 J4.8
MOT4+
  Top 0.61: IC2.13 89.53,41.59 J5.1
MOT4-
  Top 0.61: IC2.14 81,42.86 83.77,45.83 | 83.77,45.83 83.75,45.83 | J5.8 95.25,37.71 96.75,39.11 96.75,46.62 95.85,47.5 91.59,47.5 89.99,45.86 83.77,45.83
MOT_1A  (via drill 0.35)
  Top 0.35: v58.5,32.32 59.5,33.32 59.69,33.34 | v36.75,32.32 22.87,18.44 22.87,9.14 20.95,7.23 PCB1.P9.12
  Top 0.406: IC3.2 60.91,36.37 60.91,35.76 59.69,34.73 59.69,33.34
  Bottom 0.35: v36.75,32.32 v58.5,32.32
MOT_1B  (via drill 0.35)
  Top 0.35: v65,18.82 65,19.57 65.25,19.82 OPT_MOT1.4 | v45.25,11.57 31.25,11.57 31.25,11.07 27.25,7.07 27.25,5.57 26.5,4.92 24.92,4.92 PCB1.P9.13
  Bottom 0.35: v65,18.82 52.5,18.82 v45.25,11.57
MOT_2A
  Top 0.406: PCB1.P9.15 26.96,3.49 28.36,4.89 49.37,4.89 50.3,5.82 50.3,6.5 50.96,7.17 51.3,7.17 55.21,11.08 58.38,11.08 59.27,11.97 59.27,25.72 64.33,30.78 64.73,30.78 67.45,33.5 67.61,33.64 67.61,33.67 69.12,35.17 69.12,36.68 67.8,38.01 66.82,38.01 66.6,37.79 66.6,37.18 IC3.6
MOT_2B  (via drill 0.35)
  Top 0.35: v70,21.07 70,20.32 70.25,20.07 OPT_MOT1.8 | v56.75,24.57 56.75,40.57 56.79,40.69
  Top 0.406: PCB1.P8.34 47.69,52.87 47.69,50.02 50.82,46.88 50.82,46.66 56.79,40.69
  Bottom 0.35: v70,21.07 66.5,24.57 v56.75,24.57
MOT_3A  (via drill 0.35)
  Top 0.61: v66.04,44.77 IC3.9
  Bottom 0.61: PCB1.P8.44 60.34,53.07 60.34,51.25 60.34,51.22 60.34,50.53 v66.04,44.77
MOT_3B  (via drill 0.35)
  Top 0.35: v84,55.07 84.5,54.57 84.5,51.32 OPT_MOT2.4 | v79.75,58.32 73,58.32 v73,56.32
  Bottom 0.35: PCB1.P8.43 61.62,51.82 62.75,52.94 62.75,54.57 63.5,55.32 63.62,55.44 63.75,55.57 64.5,55.57 64.75,55.32 68.75,55.32 68.88,55.44 69,55.57 72.25,55.57 v73,56.32 | v84,55.07 80.75,58.32 v79.75,58.32
MOT_4A  (via drill 0.35)
  Top 0.61: v60.96,44.77 IC3.13
  Bottom 0.61: PCB1.P8.45 64.14,47.85 66.88,45.11 66.88,44.42 66.39,43.93 65.69,43.93 64.86,44.77 v60.96,44.77
MOT_4B  (via drill 0.35)
  Top 0.35: v88.5,53.07 88.5,52.32 89.5,51.32 OPT_MOT2.8 | v87.5,54.07 86,54.07 84.25,55.82 83.5,55.82 83.5,55.57 v82.5,54.57 | v79.25,52.32 74.75,52.32 74.75,51.57 v74,50.82
  Bottom 0.35: PCB1.P8.46 64.5,54.44 65.88,53.07 v71.06,53.06 71.25,53.07 71.75,53.07 v74,50.82 | v87.5,54.07 v88.5,53.07 | v82.5,54.57 80.25,52.32 v79.25,52.32
  Bottom 0.406: PCB1.P8.46 64.37,54.53
MOT_PWM_1A
  Top 0.406: PCB1.P9.14 30.48,13.02 57.07,13.02 57.42,13.5 57.49,33.47 IC3.1
MOT_PWM_1B
  Top 0.406: IC3.5 64.77,34.61 58.06,28.02 58.04,13.32 58.04,12.88 57.46,12.3 31.03,12.3 26.04,7.3 PCB1.P9.16
MOT_PWM_2A  (via drill 0.35)
  Top 0.35: v68.12,42.82 67.38,42.82 IC3.8
  Bottom 0.35: v68.12,42.82 61.38,42.82 60.12,44.07 50.02,44.07 43.52,50.57 32.25,50.57 31.12,51.69 PCB1.P8.19
MOT_PWM_2B  (via drill 0.35)
  Top 0.35: v62.25,41.19 62.25,42.69 IC3.12
  Bottom 0.35: v62.25,41.19 60,43.44 49.9,43.44 43.4,49.94 25.25,49.94 23.5,51.69 PCB1.P8.13
MOT_PWR  (via drill 0.35)
  Top 0.35: v87.5,67.82 87.5,65.32 87.75,65.07 OPT_MISC.8 | v66,64.32 65.75,64.07 65.75,57.57 65,56.82 64.02,56.82 63.37,57.47 63.25,57.47 63.25,67.07 61.5,67.07 60.75,67.82 v56.25,67.82 | v47,57.07 47.5,56.57 47.5,53.82 47,53.32 47,52.32 46.5,51.82 PCB1.P8.31
  Bottom 0.35: v87.5,67.82 83.75,71.57 75.5,71.57 68.25,64.32 v66,64.32 | v47,57.07 51.33,57.07 52.91,58.64 52.91,64.47 v56.25,67.82
N$1
  Top 0.406: R51.2 OPT_SERVO2.1
N$2
  Top 0.406: R53.2 47.42,62.47 47.98,63.03 48.11,63.22 48.12,63.43 48.07,63.45 48.07,64.07 OPT_SERVO2.3
N$3  (via drill 0.35)
  Top 0.35: v79.75,65.82 79.5,65.57 79.5,65.32 79.25,65.07 OPT_MISC.1 | v77,68.57 71.5,74.07 71.5,74.82 R27.2
  Bottom 0.35: v79.75,65.82 79.75,68.57 v77,68.57
N$5  (via drill 0.35)
  Top 0.35: v75,15.32 73.75,15.32 R1.1 | v75,19.19 75.62,19.19 v78.38,21.94
  Bottom 0.35: v75,19.19 v75,15.32 | v78.38,21.94 85,21.94 IC1.15 85.25,21.94 87.88,19.32 87.88,6.69 85.38,4.19 85.12,4.19 IC1.1
N$6  (via drill 0.35)
  Top 0.35: v73.75,33.07 73.75,31.82 R2.1 | v78.25,44.82 v74.75,44.82
  Top 0.406: v88.12,29.19 88.12,34.39 88.46,34.72 88.46,37.03 88.12,37.37 v88.12,37.69
  Bottom 0.35: v73.75,33.07 74.88,34.19 74.88,44.69 v74.75,44.82 | v78.25,44.82 84.38,44.82 85,44.19 IC2.15 85.25,44.19 88.12,41.32 v88.12,37.69 | v88.12,29.19 85.38,26.44 85.12,26.44 IC2.1
N$7
  Top 0.406: R57.2 OPT_SERVO2.7
N$8
  Top 0.406: R35.2 OPT_SERVO1.1
N$9  (via drill 0.35)
  Top 0.35: R7.2 71.75,57.32 71.75,56.57 72.75,55.57 72.75,55.32 79.5,55.32 81,53.82 82.75,53.82 83,54.07 v83.75,54.07 | v85.25,53.82 85.25,51.57 85.5,51.32 OPT_MOT2.5
  Bottom 0.35: v85.25,53.82 85,54.07 v83.75,54.07
N$10
  Top 1.016: Q5.5 Q5.6 Q5.7 Q5.8 98.38,54.34 J11.1
N$11
  Top 0.406: R37.2 OPT_SERVO1.3
N$12
  Top 0.406: R41.2 OPT_SERVO1.7
N$13  (via drill 0.35)
  Top 0.35: v83.25,52.32 81.75,52.32 80.75,51.32 OPT_MOT2.1 | v86.75,58.82 87.25,59.32 87.25,62.57 86,63.82 v84,63.82 | v73.25,65.07 72.5,64.32 72.5,63.07 71.75,62.32 R3.2
  Bottom 0.35: v83.25,52.32 86,52.32 86.75,53.07 v86.75,58.82 | v84,63.82 82.75,65.07 v73.25,65.07
N$14  (via drill 0.35)
  Top 0.35: v88.5,63.82 90.25,62.07 90.25,49.32 83.75,49.32 83.25,49.82 83.25,51.07 OPT_MOT2.3 | v73.25,64.07 73.25,61.57 71.75,60.07 R5.2
  Bottom 0.35: v88.5,63.82 86.25,66.07 85.5,66.07 80.75,70.82 76.5,70.82 72,66.32 72,64.07 v73.25,64.07
N$15  (via drill 0.35)
  Top 0.35: v86,53.32 86.25,53.32 88.25,51.32 OPT_MOT2.7 | v83.75,53.07 80.75,53.07 80.75,53.32 79.5,54.57 73.75,54.57 73.75,54.32 73.5,54.07 72,54.07 R9.2
  Bottom 0.35: v86,53.32 85.75,53.07 v83.75,53.07
N$16
  Top 0.35: OPT_MOT1.3 64.25,19.82 64.25,17.07 R21.2
N$17
  Top 0.35: OPT_MOT1.1 61.75,19.82 61.75,17.07 R19.2
N$18
  Top 0.35: OPT_MOT1.7 69.25,19.82 69.25,17.07 R25.2
N$26
  Top 0.35: OPT_MOT1.5 66.75,19.82 66.75,17.07 R23.2
N$42
  Top 0.406: R39.2 OPT_SERVO1.5
N$51  (via drill 0.35)
  Top 0.35: v78.5,66.57 80,66.57 81.5,65.07 OPT_MISC.3 | v77,66.82 75.75,68.07 75.75,68.57 72.75,71.57 71.5,71.57 R29.2
  Bottom 0.35: v78.5,66.57 78.25,66.82 v77,66.82
N$52  (via drill 0.35)
  Top 0.35: v86.25,66.82 86.25,65.32 86.5,65.07 OPT_MISC.7 | v78.5,67.82 v85.25,67.82 | v72.75,65.82 71.5,64.57 R33.2
  Bottom 0.35: v85.25,67.82 v86.25,66.82 | v78.5,67.82 78.25,67.57 74.5,67.57 v72.75,65.82
N$58
  Top 0.406: R55.2 OPT_SERVO2.5
N$64
  Top 0.35: IC6.2 65.38,79.07 65.38,79.82 65.21,80.15
  Top 0.813: 65.21,80.15 64.68,80.68 59.34,80.68 58.25,81.77 IC5.2
N$69
  Top 0.35: OPT_MISC.5 84,64.82 82.5,63.32 79.5,63.32 79.5,60.57 78.75,59.82 74,59.82 74,65.57 71.5,68.07 R31.2
N$73
  Top 0.4: R4.2 53.42,76.31 53.42,76.23 54.41,75.25 58.96,75.25
  Top 0.406: IC6.1 62.75,77.62 61.33,77.62 58.96,75.25 | R4.2 52.83,76.94
N$74
  Bottom 0.35: K1.14B 85,88.07 85.09,87.95
  Bottom 1.27: K1.14A 85.09,95.44 85.09,87.95 95.21,87.95 | 95.21,87.95 X3.1 | X2.2 96.48,89.22 95.21,87.95
N$75
  Top 0.406: K1.A1 59.79,84.48 Q6.6
  Top 0.61: Q6.8 Q6.7 59.74,84.43 59.79,84.48 | Q6.6 Q6.5
  Top 0.813: 59.48,87.67 K1.A1
N$76
  Top 0.406: IC6.3 67.27,78.41 67.27,77.74 67.49,77.52 68.55,77.52 70.16,79.14 70.25,79.14 R12.2 75.14,80.01 J12.2
  Top 0.813: R12.2 71.12,82.52 R11.1
N$77
  Top 0.406: 54.34,77.4 R4.1 55.82,77.57 56.1,77.85 60.36,77.85 61.11,78.6 Q6.4 | 54.34,77.4 54.73,77.13 54.73,77.05 | 54.34,77.4 53.22,78.52 53.22,78.53 52.73,78.89 C1.1
N$78
  Top 1.016: JP1.1 5.08,62.55 U$1.V+
N$84
  Top 0.406: R15.2 IC1.9
N$85
  Top 0.406: R16.2 IC2.9
N$86
  Top 0.406: U$2.VCC 12.05,14.94 R17.2
OPT_MOT1A  (via drill 0.35)
  Top 0.35: v78.38,2.07 79,2.07 80.38,0.69 87.5,0.69 v90.12,3.32 | v90.12,11.82 87.88,11.82 85.38,9.32 85.12,9.32 IC1.5 | v60.75,18.07 60.75,25.57 61.5,26.32 OPT_MOT1.16
  Bottom 0.35: 59.5,9.82 63,6.32 63,2.94 63.88,2.07 v78.38,2.07 | 59.5,9.82 59.38,9.94 | v90.12,11.82 v90.12,3.32 | 60.75,13.32 v60.75,18.07 | 60.75,13.32 62,13.32 63.5,11.82 RN3.2 | 60.75,13.32 60.5,13.32 59.25,12.07 59.25,9.82 59.5,9.82
OPT_MOT1B  (via drill 0.35)
  Top 0.35: v64.25,21.07 64.25,26.32 OPT_MOT1.14 | v66,7.82 66,11.57 RN3.3
  Bottom 0.35: 60,10.69 63.5,7.19 66,7.19 | 66,7.19 68,5.19 74.5,5.19 78.5,9.19 82.12,9.19 84.62,11.69 85,11.69 IC1.7 | 66.12,11.82 RN3.3 66,11.82 66,19.32 v64.25,21.07 | 66,7.19 v66,7.82
OPT_MOT2A
  Top 0.35: IC1.10 79.75,15.57 77.75,17.57 72.75,17.57 72.75,24.07 72.25,24.57 68.5,24.57 | 68.5,24.57 71.25,21.82 71.25,16.32 70.5,15.57 70.5,13.57 68.75,11.82 RN3.4 | 68.5,24.57 66.75,26.32 OPT_MOT1.12
  Bottom 0.35: 68.5,11.82 RN3.4
OPT_MOT2B  (via drill 0.35)
  Top 0.35: OPT_MOT1.10 69.25,26.32 70.25,25.32 v70.5,25.32 74.25,25.32 74.25,18.82 74.75,18.32 80,18.32 IC1.12 | v72,23.82 72,16.32 71.25,15.57 71.25,11.82 RN3.5
  Bottom 0.35: 77.38,21.94 77.38,20.57 79.75,18.19 80,18.19 IC1.12 | 71,11.82 RN3.5 | v70.5,25.32 v72,23.82
OPT_MOT3A  (via drill 0.35)
  Top 0.35: v69.75,46.19 72,48.44 72,49.82 74,51.82 74,53.82 v79,53.82 | v74.12,35.32 74.62,35.32 78.5,31.44 85,31.44 IC2.5 | RN4.2 81,61.57 81,58.07 80.75,57.82 OPT_MOT2.16 80.5,57.57 v80.5,55.32
  Bottom 0.35: v69.75,46.19 69.75,43.19 74.25,38.69 74.25,35.44 v74.12,35.32 | v79,53.82 v80.5,55.32
OPT_MOT3B  (via drill 0.35)
  Top 0.35: RN4.3 83.5,61.57 83.25,61.32 83.25,57.82 OPT_MOT2.14 83,57.57 82.75,57.32 82.75,55.82 v81.5,54.57 | v80,53.07 80,49.32 82.5,46.82 v82.62,46.82
  Bottom 0.35: v82.62,46.82 85.12,46.82 88.88,43.07 88.88,37.44 85.5,34.07 85.12,34.07 IC2.7 | v80,53.07 v81.5,54.57
OPT_MOT4A  (via drill 0.35)
  Top 0.35: v72.75,41.19 72.75,39.69 72.25,39.19 72.25,38.69 73.12,37.82 80,37.82 IC2.10 | 86,59.32 86,61.57 RN4.4 | 86,59.32 86,58.07 85.75,57.82 OPT_MOT2.12 | v84,59.32 86,59.32
  Bottom 0.35: v72.75,41.19 72.62,41.32 72.62,44.07 73.12,44.57 73.38,44.57 74.88,46.07 74.88,53.57 74.25,53.57 74.25,54.57 78.75,59.07 83.75,59.07 v84,59.32
OPT_MOT4B  (via drill 0.35)
  Top 0.35: v77.12,49.69 76.5,49.69 73.38,46.57 v73.38,43.82 | v74.12,41.07 79.38,41.07 80,40.44 IC2.12 | RN4.5 88.5,61.57 88.5,57.82 OPT_MOT2.10 88.25,57.57 88.25,53.82 v87.5,53.07
  Bottom 0.35: v73.38,43.82 73.38,41.82 v74.12,41.07 | v87.5,53.07 86,51.57 78.5,51.57 77.25,50.32 77.25,49.82 v77.12,49.69
OPT_MOT_PWR  (via drill 0.35)
  Top 0.35: IC1.6 80.12,10.57 81.25,11.69 81.38,11.69 82.88,13.19 82.88,14.82 85,16.94 IC1.11 | v64.75,53.07 66.25,54.57 v67.75,54.57 | v63,49.07 63,48.57 59,44.57 59,40.94 60.12,39.82 69.75,39.82 v72.5,37.07 | v73.5,36.07 76.5,36.07 79.75,32.82 80,32.82 IC2.6 80.12,32.57 82.25,34.69 82.25,36.44 84.75,38.94 85,38.94 IC2.11 | RN2.5 89.75,73.57 89.75,72.82 88,72.82 86.75,71.57 OPT_MISC.10 86.5,71.32 86.25,71.07 86.25,70.82 84,68.57 v81,68.57 | v81,67.07 82.25,65.82 82.25,64.32 82,64.07 v81,64.07
  Bottom 0.35: v64.75,53.07 63.88,53.07 63,52.19 v63,49.07 | v73.5,36.07 v72.5,37.07 69,37.07 66.62,34.69 66.62,34.19 73.5,27.32 73.5,14.32 77.25,10.57 80,10.57 IC1.6 | v81,67.07 v81,68.57 | v81,64.07 79.5,64.07 78.75,63.32 77.25,63.32 75.5,61.57 75.5,56.82 74.5,56.82 72.25,54.57 v67.75,54.57
OPT_SERVO1
  Top 0.4: 32.18,65.93 30.11,68 29.54,68.57 29.54,70.24 29.94,70.64 OPT_SERVO1.16
  Top 0.406: 32.18,65.93 54.23,65.93 U$4.P$1 | RN6.2 29.96,72.55 OPT_SERVO1.16
OPT_SERVO2
  Top 0.4: OPT_SERVO1.14 32.5,70.18 32.12,69.8 32.12,68.52 34.02,66.63
  Top 0.406: 34.02,66.63 54.36,66.63 60.32,60.67 U$4.P$2 | RN6.3 32.5,72.55 OPT_SERVO1.14
OPT_SERVO3
  Top 0.4: 54.4,67.41 54.29,67.31 40,67.31 39.89,67.42 35.76,67.42 34.66,68.52 34.66,69.27 35.04,69.65 OPT_SERVO1.12
  Top 0.406: U$4.P$3 58.6,63.21 54.4,67.41 | OPT_SERVO1.12 35.04,72.55 RN6.4
OPT_SERVO4
  Top 0.4: OPT_SERVO1.10 37.58,70.18 37.2,69.8 37.2,68.52 37.73,68 38.47,68 38.58,68.1 40.64,68.1
  Top 0.406: U$4.P$4 56.88,65.75 54.53,68.1 40.64,68.1 40.17,68.1 | RN6.5 37.58,72.55 OPT_SERVO1.10
OPT_SERVO5
  Top 0.35: RN5.2 45.5,73.07 45.52,73.07
  Top 0.4: 45.72,68.68 45.52,68.89 OPT_SERVO2.16
  Top 0.406: 45.72,68.68 61.64,68.68 U$4.P$5 | 45.52,73.2 45.52,73.07 OPT_SERVO2.16
OPT_SERVO6
  Top 0.35: RN5.3 48,72.82 48.05,72.82
  Top 0.4: OPT_SERVO2.14 48.7,70 48.7,69.99 49.42,69.26 50.8,69.26
  Top 0.406: 50.8,69.26 60.48,69.26 U$4.P$6 | 48.05,72.84 48.05,72.82 OPT_SERVO2.14
OPT_SERVO7
  Top 0.35: 50.59,72.82 50.5,72.82 RN5.4
  Top 0.4: RN5.4 50.9,73.07 52.5,74.66 59.2,74.66
  Top 0.406: U$4.P$19 62.04,74.31 63.17,75.44 63.17,76.37 62.51,77.03 61.57,77.03 59.2,74.66 | 50.59,72.84 50.59,72.82 OPT_SERVO2.12
OPT_SERVO8
  Top 0.35: RN5.5 53,72.82 53.13,72.82
  Top 0.4: 53.13,72.84 57.46,72.84 57.59,72.71 58.84,72.71 59.26,73.13
  Top 0.406: U$4.P$20 59.26,73.13 58.84,72.71 | 53.13,72.84 53.13,72.82 OPT_SERVO2.10
OPT_SERVO_PWR  (via drill 0.35)
  Top 0.35: OPT_MISC.12 84.25,71.57 87.25,74.57 RN2.4 | v89,76.07 89,86.57 86.75,88.82 86.75,89.82 85.5,91.07 68.75,91.07 68.75,90.57 v68.58,90.49
  Top 0.406: v27.94,99.38 62.11,99.38 62.11,98.87 v64.77,96.21
  Bottom 0.35: v89,76.07 87.5,74.57 RN2.4
  Bottom 0.406: 4.58,92.75 2.56,94.76 1.19,94.76 0.97,94.98 0.97,98.54 1.81,99.38 v27.94,99.38 | 4.58,92.75 4.8,92.75 5.08,93.03 | U$5.EN 4.58,92.75 | v68.58,90.49 68.58,92.4 v64.77,96.21
OPT_UART5_RX  (via drill 0.35)
  Top 0.35: v88.75,72.07 88.75,70.32 85.5,67.07 85,67.07 83,65.07 OPT_MISC.4 | v88.5,73.57 88.25,73.82 88.25,79.82 87.75,80.32 J7.1
  Bottom 0.35: 87.5,80.44 J7.1 | v88.75,72.07 88.75,73.32 v88.5,73.57
OPT_UART5_TX
  Top 0.35: OPT_MISC.16 79.25,71.57 79.5,71.82 79.5,72.07 82,74.57 RN2.2 82.25,74.57 82.25,77.57 85,80.32 J7.2
ORANGE
  Top 0.35: RN7.3 38,40.82 38,40.57 38.1,40.42
  Top 0.406: PCB1.P8.7 16.43,51.19 16.43,50.37 22.81,43.99 22.81,37.32 23.61,36.52 34.36,36.52 35.27,37.43 39.12,37.43 39.7,38.01 39.7,38.83 38.1,40.42
  Bottom 0.35: RN7.3 38.25,41.07 39.25,42.07 41.75,42.07 J16.3
RED  (via drill 0.35)
  Top 0.35: v25.5,53.07 24.75,52.32 24.75,51.32 28,48.07 40.5,48.07 40.5,41.07 41.75,39.82 J16.2
  Bottom 0.35: RN7.4 39.25,39.57 41.75,39.57 J16.2 | v25.5,53.07 27.25,53.07 27.25,54.57 28.25,55.57 45,55.57 46.25,54.32 PCB1.P8.32
SERVO1
  Top 0.406: PCB1.P8.27 41.24,52.89 35.04,53.05 34.93,55.04 30.7,59.37 30.72,63.26 31.22,63.71 OPT_SERVO1.2
SERVO2
  Top 0.406: PCB1.P8.28 40.02,55.55 37.93,55.55 33.77,59.71 OPT_SERVO1.4
SERVO3
  Top 0.406: OPT_SERVO1.6 36.31,63 36.91,62.5 36.91,58.94 38.59,58.94 42.6,54.93 | 42.6,55.08 42.6,54.93 | 42.6,54.93 42.57,52.85 PCB1.P8.29
SERVO4
  Top 0.406: PCB1.P8.30 43.81,55.56 40.64,58.74 40.64,62.55 39.02,64.16 OPT_SERVO1.8
SERVO5
  Top 0.406: OPT_SERVO2.2 46.78,63.85 45.35,62.73 45.35,60.57 45.34,60.55 45.3,60.77 45.33,59.86 45.34,59.87 49.78,55.43 51.91,55.43 52.58,54.76 52.58,53.59 53.27,52.89 54.45,52.89 55.59,51.75 PCB1.P8.39
SERVO6
  Top 0.406: OPT_SERVO2.4 49.33,63.63 48.82,63.11 48.82,60.97 48.89,59.96 49.42,59.43 49.42,59.3 51.84,56.87 53.01,56.87 55.59,54.29 PCB1.P8.40
SERVO7
  Top 0.406: OPT_SERVO2.6 51.88,60.01 54.52,57.37 55.05,57.37 57.47,54.95 57.85,54.95 57.84,53.73 59.05,52.61 PCB1.P8.41
SERVO8
  Top 0.406: OPT_SERVO2.8 54.41,63.64 55.24,62.8 55.18,60.75 55.18,59.64 59.03,56.16 PCB1.P8.42
SERVO_PWR  (via drill 0.35)
  Top 0.35: v84.75,65.82 84.75,65.57 85.25,65.07 OPT_MISC.6 | v75,68.32 74.75,68.07 v74.75,60.57
  Bottom 0.35: 71,58.57 69.25,56.82 69.25,56.57 68.75,56.07 68.72,56.09 68.72,56.14 | 71,58.57 72.25,59.82 72.4,59.82 | v84.75,65.82 81.25,69.32 76,69.32 v75,68.32 | v74.75,60.57 73.75,59.57 73.75,58.57 71,58.57 | 68.5,56.07 64.75,56.07 64.5,56.32 63.75,56.32 63,55.57 54.75,55.57 54.25,56.07 54.07,56 | 68.5,56.07 68.58,56 68.72,56.14 | 68.5,56.07 68.57,56.14 68.72,56.14
  Bottom 0.406: PCB1.P8.36 52.36,54.29 54.07,56 | 68.58,56 68.65,56 | 72.4,59.82 72.5,59.82 | 68.72,56.14 68.78,56.14
STOP  (via drill 0.35)
  Top 0.35: 93.5,49.94 93.75,49.94 v96.88,53.07 | v86.62,85.82 86.38,85.82 84.5,83.94 v73.5,83.94
  Top 0.406: Q5.4 93.65,49.84 93.75,49.94
  Bottom 0.35: v96.88,53.07 96.88,62.19 99,64.32 99,82.19 96,85.19 94.38,85.19 93.75,85.82 v86.62,85.82 | v73.5,83.94 65.75,76.19 65.75,72.94 64.75,71.94 61.5,71.94 53.5,63.94 53.5,57.82 52.62,56.94 52.12,56.94 51.5,56.32 | 51.5,56.32 50.25,55.07 50.25,50.07 50.38,49.94 v50.38,45.19 | 51.5,56.32 19.75,56.32 19.75,53.82 19,53.07 12.25,53.07 11,51.82 PCB1.P8.3
UART1_RX
  Bottom 0.406: PCB1.P9.26 38.73,7.6 37.59,8.74 37.59,15.24 36.63,16.21 34.29,17.93 34.29,37.15 J6.1
UART1_TX
  Bottom 0.406: PCB1.P9.24 34.8,7.43 34.8,9.68 32.97,11.51 32.97,16.06 30.82,18.21 30.82,38.76 J6.2
UART2_RX
  Bottom 0.406: PCB1.P9.22 32.84,6.85 32.84,7.67 32.26,8.25 32.26,9.68 30.43,11.51 30.43,16.06 29.13,17.36 26.14,17.36 22.86,20.64 22.86,37.15 24.13,38.42 J2.1
UART2_TX
  Bottom 0.406: PCB1.P9.21 33.66,4.42 32.26,5.82 32.26,7.43 31.28,7.43 29.98,8.74 29.98,9.71 27.94,11.75 27.94,16.29 27.45,16.77 24.18,16.77 21.59,19.37 21.59,38.42 J2.2
UART5_RX  (via drill 0.35)
  Top 0.35: v52.38,56.19 52.62,56.19 53.88,54.94 53.88,54.32 PCB1.P8.38 | RN2.3 84.5,74.32 81.75,71.57 OPT_MISC.14 81.5,71.57 81.5,71.82 v81,72.32
  Bottom 0.35: 52.62,56.19 v52.38,56.19 52.5,56.32 52.75,56.32 59,62.57 59,65.82 60.25,65.82 61.5,67.07 70.25,67.07 75.5,72.32 v81,72.32
UART5_TX  (via drill 0.35)
  Top 0.35: v68.5,56.82 68.5,53.82 64.62,49.94 64.62,49.85 | v78.5,64.07 79.5,64.07 80.25,64.82 OPT_MISC.2
  Top 0.406: 64.62,49.85 55.88,49.85 PCB1.P8.37
  Bottom 0.35: v78.5,64.07 74.75,64.07 68.5,57.82 v68.5,56.82
V+  (via drill 0.35)
  Top 0.35: IC3.14 59.75,42.82 v59.8,41.06
  Top 1: 6.81,52.39 6.82,52.38 6.82,51.16 10.16,47.82 J8.4
  Top 1.016: J8.4 11.81,44.38 11.81,30.35 11.49,30.03 11.49,19.43 9.14,17.08 | JP1.2 7.62,55.7 6.81,54.89 6.81,52.39 6.81,52.14
  Top 1.2: 9.14,17.08 9.14,10.23 PCB1.P9.6
  Top 1.27: PCB1.P9.6 PCB1.P9.5
  Bottom 0.35: J6.4 33.62,46.07 36.5,42.26 36.5,37.94 37.44,37.01 | 37.5,36.94 37.44,37.01 | 37.44,37.01 37.5,37.07 39,37.07 40.25,35.82 54.61,35.88 v59.8,41.06
  Bottom 1.016: C6.+ 7.62,64.75 JP1.2
  Bottom 1.27: J2.4 J6.4 J8.4 J9.4
V-  (via drill 0.35, 0.7)
  Top 0.35: v99.12,37.07 99.12,17.44 96.88,15.19 v96.88,15.07 96.88,14.44 97.62,13.69 v97.62,6.07 97.62,3.94 v94.25,0.57 | v87.38,31.82 86.5,32.69 v82.62,32.69 | v74.12,34.44 v77.12,31.44 | v67.38,34.44 67.05,34.44 | v67.12,0.57 64.25,3.44 PCB1.P9.45
  Top 0.406: PCB1.P9.43 61.59,5.4 | 61.59,5.4 PCB1.P9.44 | 61.59,5.4 62.23,6.03 PCB1.P9.46 PCB1.P9.45 | PCB1.P9.34 54.56,11.7 57.15,11.7 | 57.15,11.7 57.65,11.7 | IC3.7 67.05,35.91 67.05,34.44 65.78,33.92 58.69,26.68 58.69,12.71 57.7,11.72 57.17,11.72 57.15,11.7
  Bottom 0.35: v97.62,6.07 95.25,6.07 J1.6 | v96.88,15.07 95.25,16.69 J3.6 | v99.12,37.07 95.25,40.94 J5.6 | J4.6 95.25,28.82 96.62,27.44 96.62,26.44 95.88,25.69 92.12,25.69 88.88,28.94 88.88,30.32 v87.38,31.82 | v82.62,32.69 82.25,32.32 82.25,32.19 81.5,31.44 v77.12,31.44 | v67.38,34.44 v74.12,34.44 | 44.5,20.94 44.5,10.44 48.88,6.07 PCB1.P9.34 49,5.94 50.12,4.82 50.12,3.19 51,2.32 59.5,2.32 60.62,3.44 61.5,3.44 PCB1.P9.43 | v67.12,0.57 v94.25,0.57 | 35.88,27.15 35.88,41.21 33.25,43.84 33.25,42.94 J6.3 | 44.5,37.32 J15.4
  Bottom 0.406: 35.88,27.15 39.69,27.15 44.38,21.19
  Bottom 1.27: PCB1.P9.1 PCB1.P9.2 8.89,5.4 | J9.3 J8.3 J6.3 J2.3 3.81,43.5 3.81,47.31 PCB1.P8.1 PCB1.P8.2 8.26,55.56 8.89,56.2 17.78,56.2 U$1.V- 16.85,63.82 C6.-
  other vias: 1.27,62.55 8.89,67.63 8.89,63.82 10.16,71.44 3.81,71.44 17.78,60.01 24.13,61.28 19.05,63.82 12.7,60.01 2.54,57.47 15.24,57.47 26.67,57.47 2.54,47.31 15.24,9.21 12.7,29.53 29.21,21.91 36.83,20.64 31.75,28.26 27.94,28.26 48.26,9.21 52.07,10.48 71.86,3.11 44.45,16.83 66.27,3.22
  pour Bottom: 15.24,73.98 15.24,63.82 27.94,63.82 27.94,66.36 58.42,66.36 58.42,53.66 73.66,53.66 73.66,28.26 58.42,28.26 58.42,10.48 72.39,10.48 72.39,-4.76 0,-4.76 0,73.98
  pour Top: 0,73.98 13.97,73.98 13.97,66.36 57.15,66.36 57.15,56.2 66.04,56.2 66.04,46.04 73.66,46.04 73.66,-4.76 66.04,-4.76 0,-4.76

## Text on the board
tPlace: starter | arduino | battery | 6v | sig | stop | red button | i2c1 | uart2 | uart1 | i2c2 | green | orange | red | col1 | col2 | stop | Les Beffroyables / Main board 0.2b / by Hugo van Santen | trigger
tValues: 12V check | gnd